# Altium project BLDC_driver_sensorless.PrjPcb
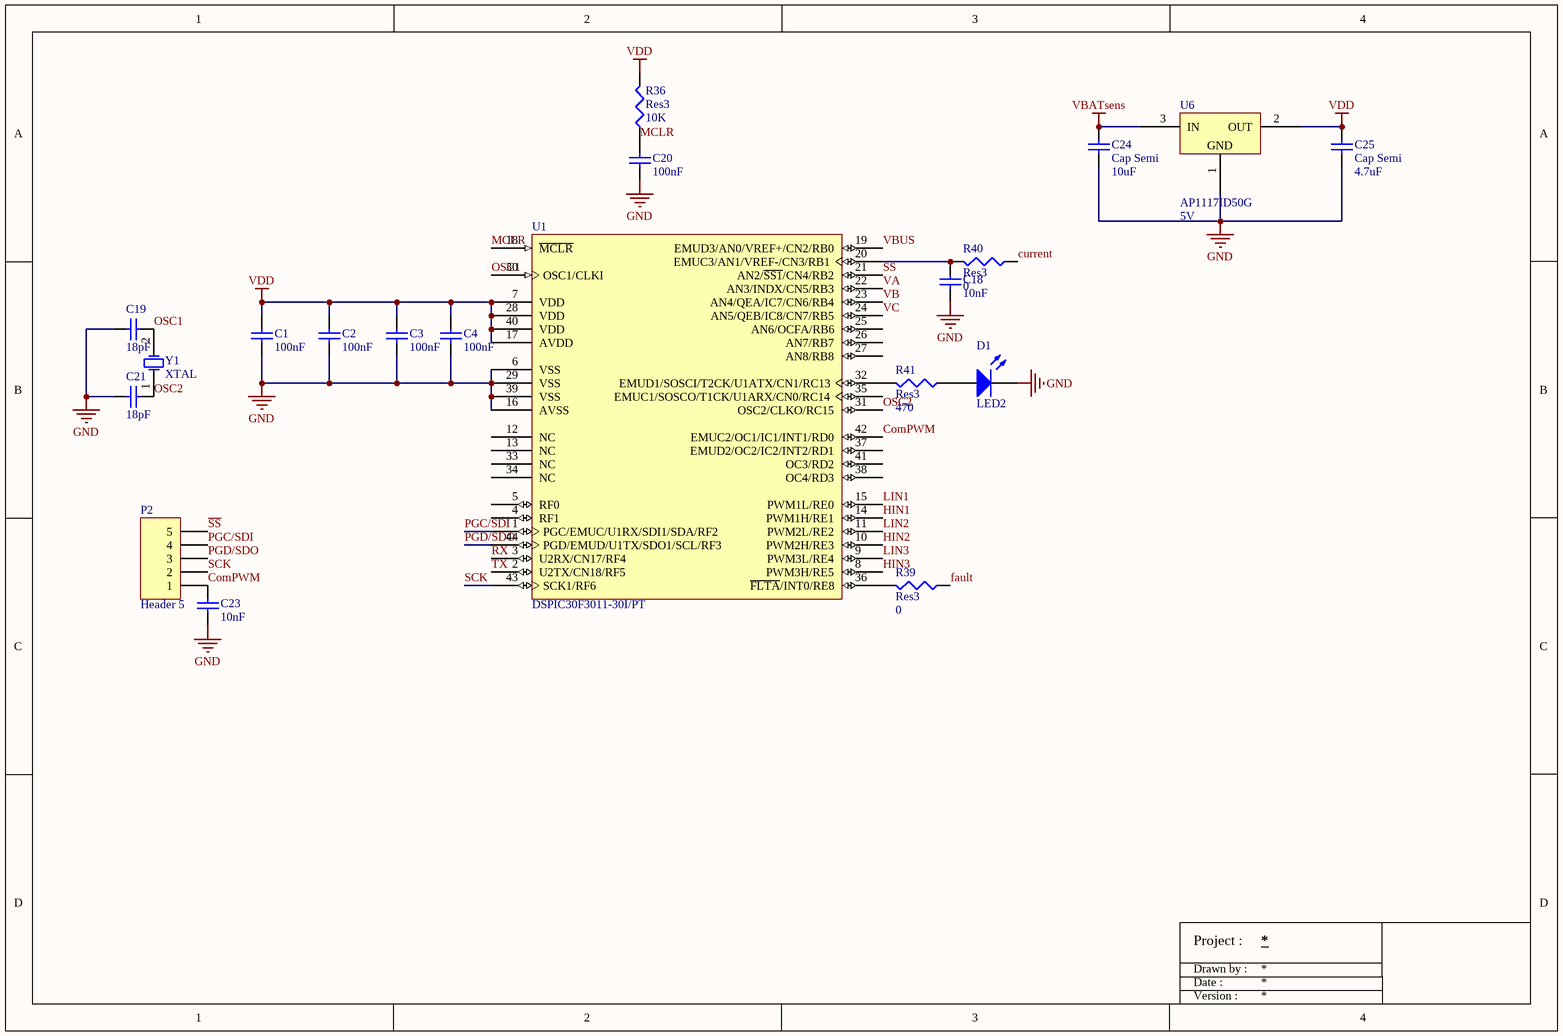
[diagram p0: BLDC_driver_sensorless_logic.SchDoc]
2 sheets, 95 parts. Net scope: global (net labels, ports and power ports of the same name join across sheets).
Board files: BLDC_driver_sensorless.PcbDoc, PCB_gravure_x4.PcbDoc, BLDC_driver_sensorless_v2.PcbDoc
Sheets:
  BLDC_driver_sensorless_logic.SchDoc
  BLDC_driver_sensorless_power.SchDoc

## Sheet BLDC_driver_sensorless_logic.SchDoc
size A4

### Parts
C1  value 100nF  [1206 capacitor]  (hidden comment: Cap SMD)
C2  value 100nF  [1206 capacitor]  (hidden comment: Cap SMD)
C3  value 100nF  [1206 capacitor]  (hidden comment: Cap SMD)
C4  value 100nF  [1206 capacitor]  (hidden comment: Cap SMD)
C18  value 10nF  [1206 capacitor]  (hidden comment: Cap SMD)
C19  value 18pF  [1206 capacitor]  (hidden comment: Cap SMD)
C20  value 100nF  [1206 capacitor]  (hidden comment: Cap SMD)
C21  value 18pF  [1206 capacitor]  (hidden comment: Cap SMD)
C23  value 10nF  [1206 capacitor]  (hidden comment: Cap SMD)
C24  Cap Semi  value 10uF  [1206 capacitor]
C25  Cap Semi  value 4.7uF  [1206 capacitor]
D1  LED2  [LED 1206 BLUE]
P2  Header 5  [HDR1X5]
R36  Res3  value 10K  [1206 resistor]
R39  Res3  value 0  [1206 resistor]
R40  Res3  value 0  [1206 resistor]
R41  Res3  value 470  [1206 resistor]
U1  DSPIC30F3011-30I/PT  [TQFP-PT44_N]
U6  AP1117ID50G  value 5V  [TO-252]
Y1  XTAL  [HC49/US]

### Nets
GND: C1.1 C2.1 C3.1 C4.1 C18.1 C19.2 C20.1 C21.2 C23.1 C24.1 C25.1 D1.2(K) U1.6(VSS) U1.16(AVSS) U1.29(VSS) U1.39(VSS) U6.1(GND)
VBATsens: C24.2 U6.3(IN)
VDD: C1.2 C2.2 C3.2 C4.2 C25.2 R36.2 U1.7(VDD) U1.17(AVDD) U1.28(VDD) U1.40(VDD) U6.2(OUT)
ComPWM: C23.2 P2.1 U1.42(EMUC2/OC1/IC1/INT1/RD0)
current: R40.1
fault: R39.1
HIN1: U1.14(PWM1H/RE1)
HIN2: U1.10(PWM2H/RE3)
HIN3: U1.8(PWM3H/RE5)
LIN1: U1.15(PWM1L/RE0)
LIN2: U1.11(PWM2L/RE2)
LIN3: U1.9(PWM3L/RE4)
MCLR: C20.2 R36.1 U1.18(~{MCLR})
OSC1: C19.1 U1.30(OSC1/CLKI) Y1.2(OSC2)
OSC2: C21.1 U1.31(OSC2/CLKO/RC15) Y1.1(OSC1)
PGC/SDI: P2.4 U1.1(PGC/EMUC/U1RX/SDI1/SDA/RF2)
PGD/SDO: P2.3 U1.44(PGD/EMUD/U1TX/SDO1/SCL/RF3)
RX: U1.3(U2RX/CN17/RF4)
~{SS}: P2.5 U1.21(AN2/~{SS1}/CN4/RB2)
SCK: P2.2 U1.43(SCK1/RF6)
TX: U1.2(U2TX/CN18/RF5)
VA: U1.22(AN3/INDX/CN5/RB3)
VB: U1.23(AN4/QEA/IC7/CN6/RB4)
VBUS: U1.19(EMUD3/AN0/VREF+/CN2/RB0)
VC: U1.24(AN5/QEB/IC8/CN7/RB5)
NetC18_2: C18.2 R40.2 U1.20(EMUC3/AN1/VREF-/CN3/RB1)
NetD1_1: D1.1(A) R41.1
NetR39_2: R39.2 U1.36(~{FLTA}/INT0/RE8)
NetR41_2: R41.2 U1.32(EMUD1/SOSCI/T2CK/U1ATX/CN1/RC13)

Not connected (* = marked no-connect by the designer): U1 4(RF1) 5(RF0) 12(NC) 13(NC) 25(AN6/OCFA/RB6) 26(AN7/RB7) 27(AN8/RB8) 33(NC) 34(NC) 35(EMUC1/SOSCO/T1CK/U1ARX/CN0/RC14) 37(EMUD2/OC2/IC2/INT2/RD1) 38(OC4/RD3) 41(OC3/RD2)

### Notes on the sheet
- Drawn by :
- Date :
- Project :
- Version :

### Library data of the parts
C1-C4 C18-C21 C23 = Cap SMD: SMD capacitor
C24 C25 = Cap Semi: Capacitor (Semiconductor SIM Model); Published: 8-Jun-2000; LatestRevisionDate: 29-May-2009; LatestRevisionNote: IPC-7351 Footprint Added.; PackageReference: C1206; Publisher: Altium Limited; PackageDescription: Chip Capacitor
D1 = LED2: Typical RED, GREEN, YELLOW, AMBER GaAs LED; Published: 8-Jun-2000; LatestRevisionDate: 17-Jul-2002; LatestRevisionNote: Re-released for DXP Platform.; PackageVersion: Feb-2002; PackageReference: 3.2X1.6X1.1; Publisher: Altium Limited; PackageDescription: SM LED; 2 Flat Leads
P2 = Header 5: Header, 5-Pin; LatestRevisionDate: 17-Jul-2002; LatestRevisionNote: Re-released for DXP Platform.; Publisher: Altium Limited
R36 R39-R41 = Res3: Resistor; Published: 8-Jun-2000; LatestRevisionDate: 29-May-2009; LatestRevisionNote: IPC-7351 Footprint Added.; PackageReference: J1-0603; Publisher: Altium Limited; PackageDescription: Chip Resistor
U1 = DSPIC30F3011-30I/PT: High-Performance 16-bit Digital Signal Controller, 24 KB Flash, 1 KB SRAM, 1 KB EEPROM, 44-Pin TQFP, Industrial Temperature; FirstPublished: 29-Jan-2009; DatasheetVersion: revE, Apr-2008; PackageVersion: revBB, Aug-2009; PackageReference: TQFP-PT44; Publisher: Altium Limited; PackageDescription: 44-Lead Plastic Thin Quad Flatpack (PT) - 10x10x1mm Body, 2.00mm [TQFP]; Supplier 1: Digi-Key; Supplier Part Number 1: DSPIC30F301130IPT-ND; Supplier 2: Newark; Supplier Part Number 2: 71J3705; Code_JEDEC: MS-026; ComponentLink1Description: Datasheet; ComponentLink1URL: http://ww1.microchip.com/downloads/en/DeviceDoc/70141e.pdf; ComponentLink2Description: Packaging Specification; ComponentLink2URL: http://www.microchip.com/stellent/groups/techpub_sg/documents/packagingspec/en012702.pdf; ComponentLink3Description: Microchip.com Home; ComponentLink3URL: http://www.microchip.com/
U6 = AP1117ID50G: LDO Voltage Regulator; Published: 8-Jun-2000; LatestRevisionDate: 17-Jul-2002; LatestRevisionNote: Re-released for DXP Platform.; PackageReference: RAD-0.3; Publisher: Altium Limited; PackageDescription: Radial Cap, Thru-Hole; 2 Leads; 0.3 in Pin Spacing
Y1 = XTAL: Crystal Oscillator; Published: 8-Jun-2000; LatestRevisionDate: 17-Jul-2002; LatestRevisionNote: Re-released for DXP Platform.; PackageReference: R38; Publisher: Altium Limited; PackageDescription: Crystal, Thru-Hole; 2 Leads; Body 3.1 x 8.2 mm (Dia.xH)

## Sheet BLDC_driver_sensorless_power.SchDoc
size A4
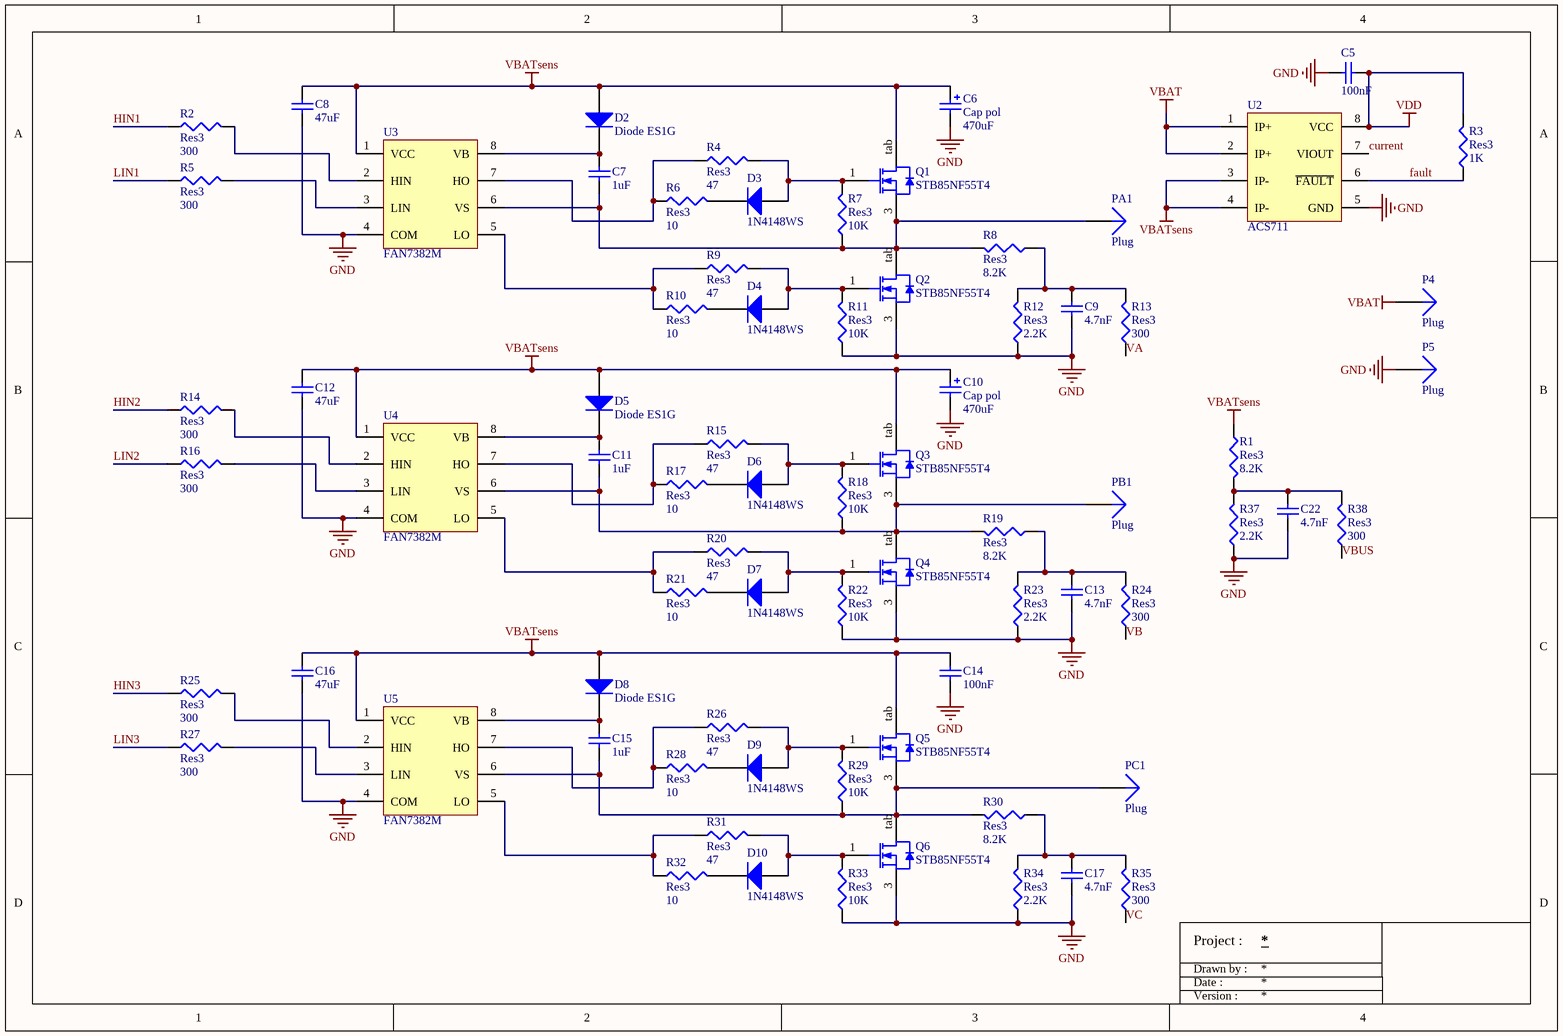
[diagram p1: BLDC_driver_sensorless_power.SchDoc]

### Parts
C5  value 100nF  [1206 capacitor]  (hidden comment: Cap SMD)
C6  Cap pol  value 470uF  [Cap elec 10x16-5 Surface Mount]
C7  value 1uF  [1206 capacitor]  (hidden comment: Cap SMD)
C8  value 47uF  [1206 capacitor]  (hidden comment: Cap SMD)
C9  value 4.7nF  [1206 capacitor]  (hidden comment: Cap SMD)
C10  Cap pol  value 470uF  [Cap elec 10x16-5 Surface Mount]
C11  value 1uF  [1206 capacitor]  (hidden comment: Cap SMD)
C12  value 47uF  [1206 capacitor]  (hidden comment: Cap SMD)
C13  value 4.7nF  [1206 capacitor]  (hidden comment: Cap SMD)
C14  value 100nF  [1206 capacitor]  (hidden comment: Cap SMD)
C15  value 1uF  [1206 capacitor]  (hidden comment: Cap SMD)
C16  value 47uF  [1206 capacitor]  (hidden comment: Cap SMD)
C17  value 4.7nF  [1206 capacitor]  (hidden comment: Cap SMD)
C22  value 4.7nF  [1206 capacitor]  (hidden comment: Cap SMD)
D2  Diode ES1G  [DO-214AC]
D3  1N4148WS  [SOD323]
D4  1N4148WS  [SOD323]
D5  Diode ES1G  [DO-214AC]
D6  1N4148WS  [SOD323]
D7  1N4148WS  [SOD323]
D8  Diode ES1G  [DO-214AC]
D9  1N4148WS  [SOD323]
D10  1N4148WS  [SOD323]
P4  Plug  [PIN1]
P5  Plug  [PIN1]
PA1  Plug  [PIN1]
PB1  Plug  [PIN1]
PC1  Plug  [PIN1]
Q1  STB85NF55T4  [TO-263-2]
Q2  STB85NF55T4  [TO-263-2]
Q3  STB85NF55T4  [TO-263-2]
Q4  STB85NF55T4  [TO-263-2]
Q5  STB85NF55T4  [TO-263-2]
Q6  STB85NF55T4  [TO-263-2]
R1  Res3  value 8.2K  [1206 resistor]
R2  Res3  value 300  [1206 resistor]
R3  Res3  value 1K  [1206 resistor]
R4  Res3  value 47  [1206 resistor]
R5  Res3  value 300  [1206 resistor]
R6  Res3  value 10  [1206 resistor]
R7  Res3  value 10K  [1206 resistor]
R8  Res3  value 8.2K  [1206 resistor]
R9  Res3  value 47  [1206 resistor]
R10  Res3  value 10  [1206 resistor]
R11  Res3  value 10K  [1206 resistor]
R12  Res3  value 2.2K  [1206 resistor]
R13  Res3  value 300  [1206 resistor]
R14  Res3  value 300  [1206 resistor]
R15  Res3  value 47  [1206 resistor]
R16  Res3  value 300  [1206 resistor]
R17  Res3  value 10  [1206 resistor]
R18  Res3  value 10K  [1206 resistor]
R19  Res3  value 8.2K  [1206 resistor]
R20  Res3  value 47  [1206 resistor]
R21  Res3  value 10  [1206 resistor]
R22  Res3  value 10K  [1206 resistor]
R23  Res3  value 2.2K  [1206 resistor]
R24  Res3  value 300  [1206 resistor]
R25  Res3  value 300  [1206 resistor]
R26  Res3  value 47  [1206 resistor]
R27  Res3  value 300  [1206 resistor]
R28  Res3  value 10  [1206 resistor]
R29  Res3  value 10K  [1206 resistor]
R30  Res3  value 8.2K  [1206 resistor]
R31  Res3  value 47  [1206 resistor]
R32  Res3  value 10  [1206 resistor]
R33  Res3  value 10K  [1206 resistor]
R34  Res3  value 2.2K  [1206 resistor]
R35  Res3  value 300  [1206 resistor]
R37  Res3  value 2.2K  [1206 resistor]
R38  Res3  value 300  [1206 resistor]
U2  ACS711  [SOIC8]
U3  FAN7382M  [SOIC8]
U4  FAN7382M  [SOIC8]
U5  FAN7382M  [SOIC8]

### Nets
GND: C5.2 C6.2 C8.1 C9.2 C10.2 C12.1 C13.2 C14.2 C16.1 C17.2 C22.2 P5.1 Q2.3(S) Q4.3(S) Q6.3(S) R11.1 R12.1 R22.1 R23.1 R33.1 R34.1 R37.1 U2.5(GND) U3.4(COM) U4.4(COM) U5.4(COM)
VBAT: P4.1 U2.1(IP+) U2.2(IP+)
VBATsens: C6.1 C8.2 C10.1 C12.2 C14.1 C16.2 D2.A D5.A D8.A Q1.tab(D) Q3.tab(D) Q5.tab(D) R1.1 U2.3(IP-) U2.4(IP-) U3.1(VCC) U4.1(VCC) U5.1(VCC)
VDD: C5.1 R3.2 U2.8(VCC)
current: U2.7(VIOUT)
fault: R3.1 U2.6(~{FAULT})
HIN1: R2.1
HIN2: R14.1
HIN3: R25.1
LIN1: R5.1
LIN2: R16.1
LIN3: R27.1
VA: R13.1
VB: R24.1
VBUS: R38.1
VC: R35.1
NetC7_1: C7.1 D2.K U3.8(VB)
NetC7_2: C7.2 PA1.1 Q1.3(S) Q2.tab(D) R7.1 R8.2 U3.6(VS)
NetC9_1: C9.1 R8.1 R12.2 R13.2
NetC11_1: C11.1 D5.K U4.8(VB)
NetC11_2: C11.2 PB1.1 Q3.3(S) Q4.tab(D) R18.1 R19.2 U4.6(VS)
NetC13_1: C13.1 R19.1 R23.2 R24.2
NetC15_1: C15.1 D8.K U5.8(VB)
NetC15_2: C15.2 PC1.1 Q5.3(S) Q6.tab(D) R29.1 R30.2 U5.6(VS)
NetC17_1: C17.1 R30.1 R34.2 R35.2
NetC22_1: C22.1 R1.2 R37.2 R38.2
NetD3_1: D3.1(A) Q1.1(G) R4.2 R7.2
NetD3_2: D3.2(K) R6.2
NetD4_1: D4.1(A) Q2.1(G) R9.2 R11.2
NetD4_2: D4.2(K) R10.2
NetD6_1: D6.1(A) Q3.1(G) R15.2 R18.2
NetD6_2: D6.2(K) R17.2
NetD7_1: D7.1(A) Q4.1(G) R20.2 R22.2
NetD7_2: D7.2(K) R21.2
NetD9_1: D9.1(A) Q5.1(G) R26.2 R29.2
NetD9_2: D9.2(K) R28.2
NetD10_1: D10.1(A) Q6.1(G) R31.2 R33.2
NetD10_2: D10.2(K) R32.2
NetR2_2: R2.2 U3.2(HIN)
NetR4_1: R4.1 R6.1 U3.7(HO)
NetR5_2: R5.2 U3.3(LIN)
NetR9_1: R9.1 R10.1 U3.5(LO)
NetR14_2: R14.2 U4.2(HIN)
NetR15_1: R15.1 R17.1 U4.7(HO)
NetR16_2: R16.2 U4.3(LIN)
NetR20_1: R20.1 R21.1 U4.5(LO)
NetR25_2: R25.2 U5.2(HIN)
NetR26_1: R26.1 R28.1 U5.7(HO)
NetR27_2: R27.2 U5.3(LIN)
NetR31_1: R31.1 R32.1 U5.5(LO)

### Notes on the sheet
- Drawn by :
- Date :
- Project :
- Version :

### Library data of the parts
C5 C7-C9 C11-C17 C22 = Cap SMD: SMD capacitor
C6 C10 = Cap pol: Capa pol through hole
D2 D5 D8 = Diode ES1G: 1.0A SURFACE MOUNT SUPER-FAST RECTIFIER
D3 D4 D6 D7 D9 D10 = 1N4148WS: Diode commutation
Q1-Q6 = STB85NF55T4: MOSFET Canal-N, 80A 55V
R1-R35 R37 R38 = Res3: Resistor; Published: 8-Jun-2000; LatestRevisionDate: 29-May-2009; LatestRevisionNote: IPC-7351 Footprint Added.; PackageReference: J1-0603; Publisher: Altium Limited; PackageDescription: Chip Resistor
U2 = ACS711: +/-12A HALL EFFECT CURRENT SENSOR
U3-U5 = FAN7382M: High and Low Side Gate Driver
P4 P5 PA1 PB1 PC1 = Plug: LatestRevisionDate: 17-Jul-2002; LatestRevisionNote: Re-released for DXP Platform.; Publisher: Altium Limited

## Nets that join several sheets
GND: BLDC_driver_sensorless_logic (17 pins), BLDC_driver_sensorless_power (26 pins)
VBATsens: BLDC_driver_sensorless_logic (C24.2 U6.3), BLDC_driver_sensorless_power (18 pins)
VDD: BLDC_driver_sensorless_logic (11 pins), BLDC_driver_sensorless_power (C5.1 R3.2 U2.8)
current: BLDC_driver_sensorless_logic (R40.1), BLDC_driver_sensorless_power (U2.7)
fault: BLDC_driver_sensorless_logic (R39.1), BLDC_driver_sensorless_power (R3.1 U2.6)
HIN1: BLDC_driver_sensorless_logic (U1.14), BLDC_driver_sensorless_power (R2.1)
HIN2: BLDC_driver_sensorless_logic (U1.10), BLDC_driver_sensorless_power (R14.1)
HIN3: BLDC_driver_sensorless_logic (U1.8), BLDC_driver_sensorless_power (R25.1)
LIN1: BLDC_driver_sensorless_logic (U1.15), BLDC_driver_sensorless_power (R5.1)
LIN2: BLDC_driver_sensorless_logic (U1.11), BLDC_driver_sensorless_power (R16.1)
LIN3: BLDC_driver_sensorless_logic (U1.9), BLDC_driver_sensorless_power (R27.1)
VA: BLDC_driver_sensorless_logic (U1.22), BLDC_driver_sensorless_power (R13.1)
VB: BLDC_driver_sensorless_logic (U1.23), BLDC_driver_sensorless_power (R24.1)
VBUS: BLDC_driver_sensorless_logic (U1.19), BLDC_driver_sensorless_power (R38.1)
VC: BLDC_driver_sensorless_logic (U1.24), BLDC_driver_sensorless_power (R35.1)